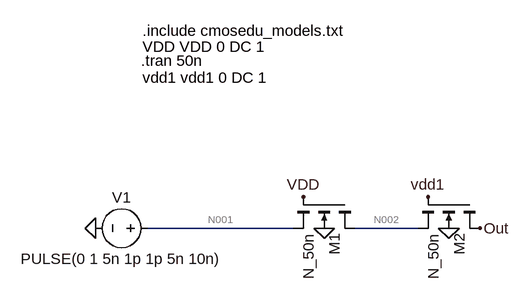
[diagram p0: schematic Draft1.asc]
Draft1.asc, the LTspice schematic file:
Version 4
SHEET 1 880 680
WIRE 112 272 -112 272
WIRE 304 272 208 272
FLAG 128 224 VDD
FLAG 320 224 vdd1
FLAG 160 272 0
FLAG 352 272 0
FLAG -192 272 0
FLAG 400 272 Out
SYMBOL nmos4 208 224 R90
SYMATTR InstName M1
SYMATTR Value N_50n
SYMATTR Value2 l=50n w=1u
SYMBOL nmos4 400 224 R90
SYMATTR InstName M2
SYMATTR Value N_50n
SYMATTR Value2 l=50n w=1u
SYMBOL voltage -96 272 R90
WINDOW 0 -32 56 VBottom 2
WINDOW 3 32 56 VTop 2
WINDOW 123 0 0 Left 0
WINDOW 39 0 0 Left 0
SYMATTR InstName V1
SYMATTR Value PULSE(0 1 5n 1p 1p 5n 10n)
TEXT -120 -32 Left 2 !.include cmosedu_models.txt
TEXT -120 -8 Left 2 !VDD VDD 0 DC 1
TEXT -122 14 Left 2 !.tran 50n
TEXT -120 40 Left 2 !vdd1 vdd1 0 DC 1

The netlist it stands for:
* Draft1.asc
M1 N002 VDD N001 0 N_50n l=50n w=1u
M2 Out vdd1 N002 0 N_50n l=50n w=1u
V1 N001 0 PULSE(0 1 5n 1p 1p 5n 10n)
.model NMOS NMOS
.model PMOS PMOS
.lib standard.mos
.include cmosedu_models.txt
VDD VDD 0 DC 1
.tran 50n
vdd1 vdd1 0 DC 1
.backanno
.end

* Results of the author's LTspice run, read from the files saved beside the schematic
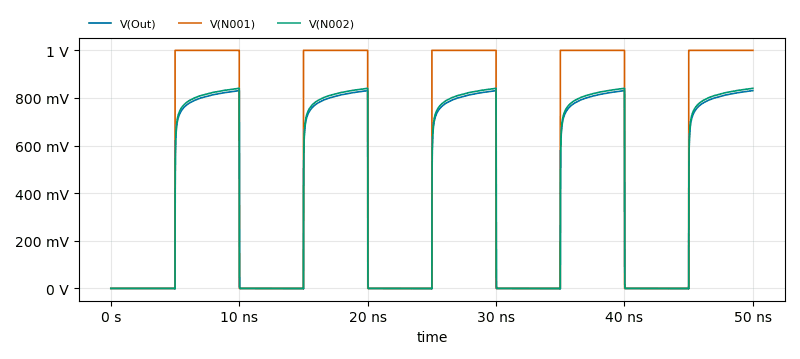
[diagram p1: Transient Analysis of Draft1.asc, plotted from the saved traces]
* Transient Analysis, 1 run:
*   V(Out): min -1.581 mV, max 831 mV, average 397.3 mV, rms 562.4 mV, last 831 mV
*   V(N001): min 0 V, max 1 V, average 500.1 mV, rms 707.1 mV, last 1 V
*   V(N002): min -1.044 mV, max 840.6 mV, average 402.4 mV, rms 569.6 mV, last 840.6 mV